# EAGLE design kaaEmonitor_2v0 (EAGLE 6.5.0)
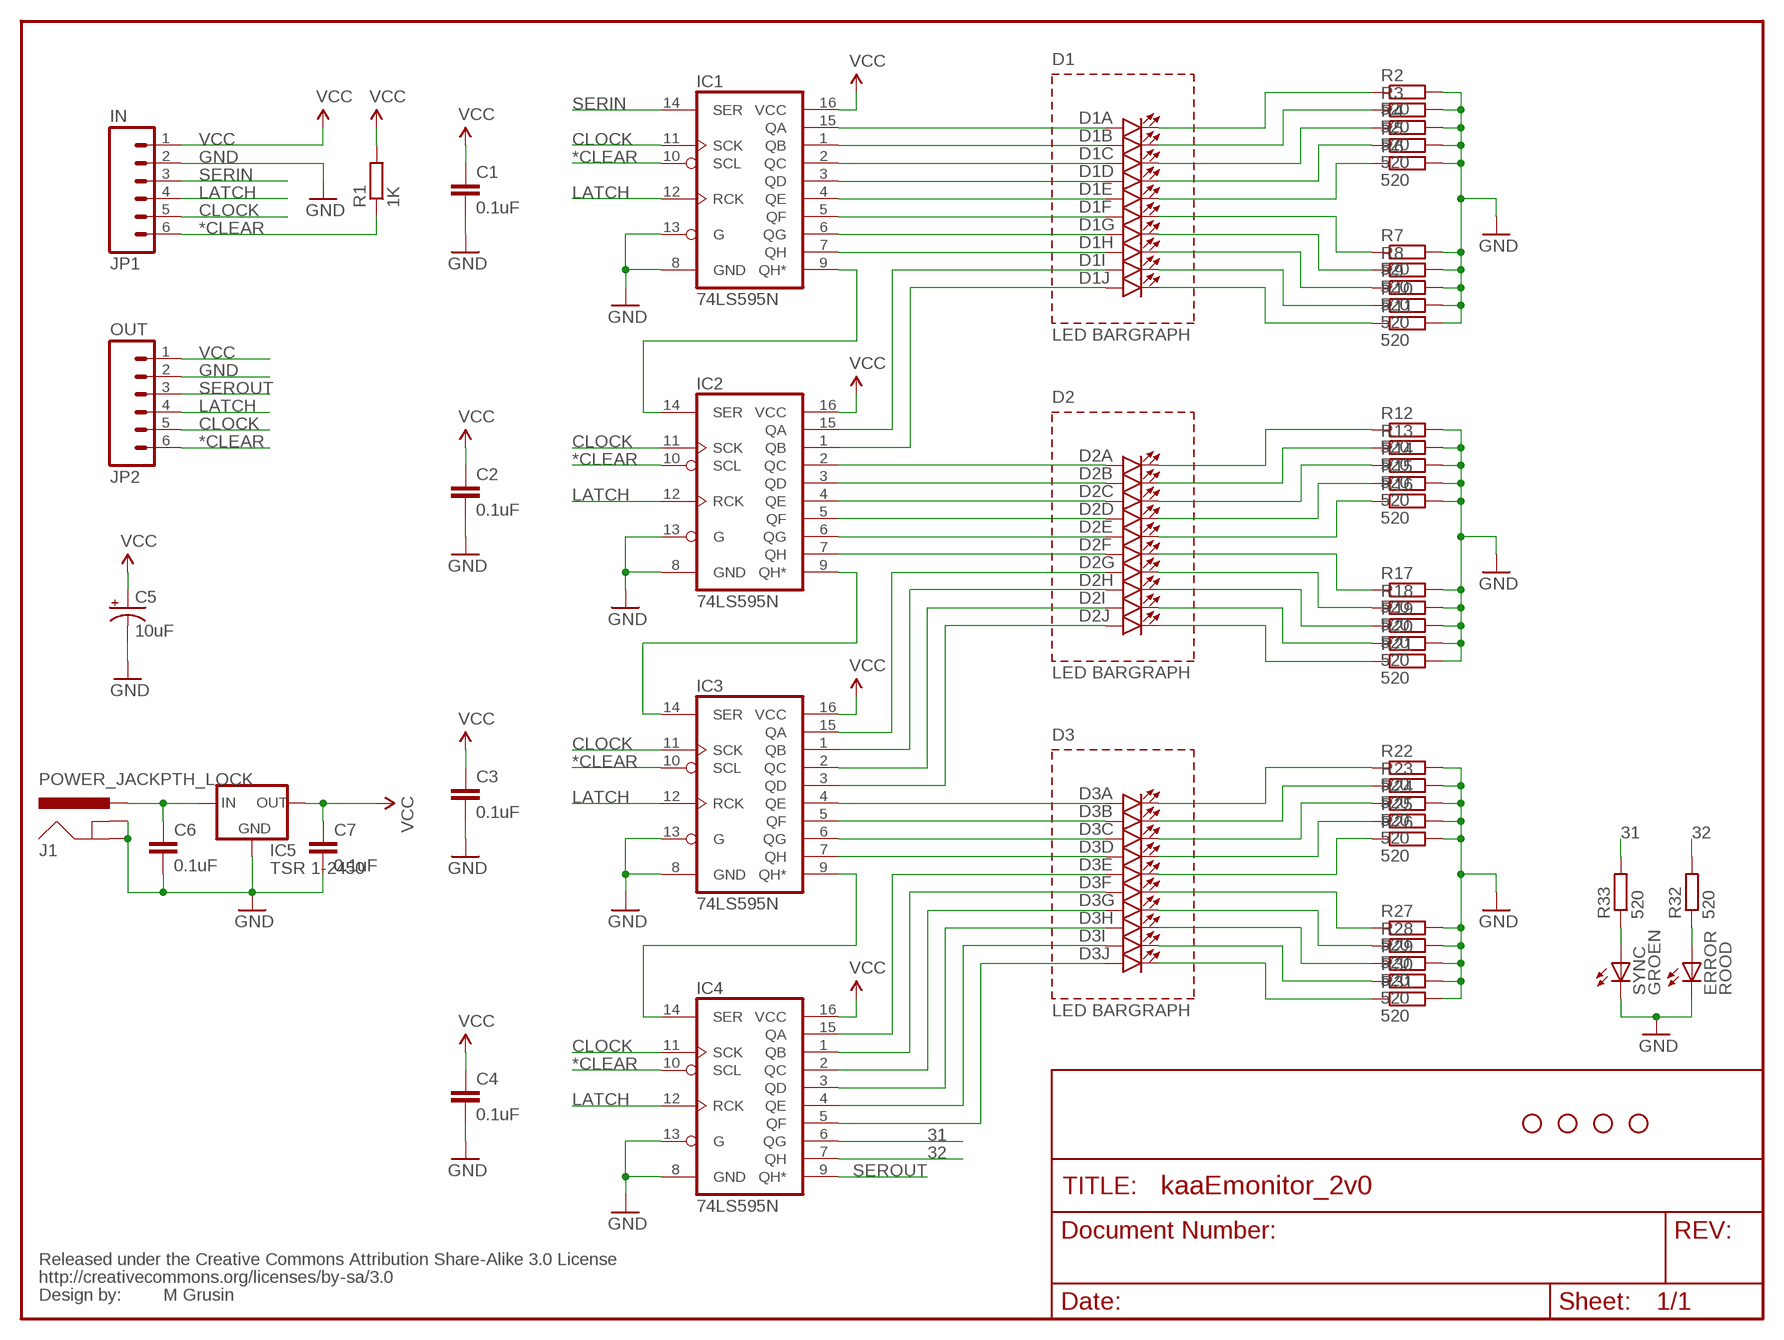
[diagram p0: schematic, sheet 1]

## Parts
C1  0.1uF  CAPPTH2  [CAP-PTH-SMALL2]
C2  0.1uF  CAPPTH2  [CAP-PTH-SMALL2]
C3  0.1uF  CAPPTH2  [CAP-PTH-SMALL2]
C4  0.1uF  CAPPTH2  [CAP-PTH-SMALL2]
C5  10uF  CAP_POLPTH2  [CPOL-RADIAL-10UF-25V]
C6  0.1uF  CAPPTH2  [CAP-PTH-SMALL2]
C7  0.1uF  CAPPTH2  [CAP-PTH-SMALL2]
D1  LED_BARGRAPH_10  [LED_BARGAPH_10]
D2  LED_BARGRAPH_10  [LED_BARGAPH_10]
D3  LED_BARGRAPH_10  [LED_BARGAPH_10]
ERROR  ROOD  LED3MM  [LED3MM]
IC1  74LS595N  [DIL16]
IC2  74LS595N  [DIL16]
IC3  74LS595N  [DIL16]
IC4  74LS595N  [DIL16]
IC5  TSR 1-2450  V_REG_78XXSINK  [TO220-IGO]
J1  POWER_JACKPTH_LOCK  [POWER_JACK_PTH_LOCK]
JP1  IN  M06SIP  [1X06]
JP2  OUT  M06SIP  [1X06]
R1  1K  R-EU_0204/5  [0204/5]
R2  520  R-EU_0204/5  [0204/5]
R3  520  R-EU_0204/5  [0204/5]
R4  520  R-EU_0204/5  [0204/5]
R5  520  R-EU_0204/5  [0204/5]
R6  520  R-EU_0204/5  [0204/5]
R7  520  R-EU_0204/5  [0204/5]
R8  520  R-EU_0204/5  [0204/5]
R9  520  R-EU_0204/5  [0204/5]
R10  520  R-EU_0204/5  [0204/5]
R11  520  R-EU_0204/5  [0204/5]
R12  520  R-EU_0204/5  [0204/5]
R13  520  R-EU_0204/5  [0204/5]
R14  520  R-EU_0204/5  [0204/5]
R15  520  R-EU_0204/5  [0204/5]
R16  520  R-EU_0204/5  [0204/5]
R17  520  R-EU_0204/5  [0204/5]
R18  520  R-EU_0204/5  [0204/5]
R19  520  R-EU_0204/5  [0204/5]
R20  520  R-EU_0204/5  [0204/5]
R21  520  R-EU_0204/5  [0204/5]
R22  520  R-EU_0204/5  [0204/5]
R23  520  R-EU_0204/5  [0204/5]
R24  520  R-EU_0204/5  [0204/5]
R25  520  R-EU_0204/5  [0204/5]
R26  520  R-EU_0204/5  [0204/5]
R27  520  R-EU_0204/5  [0204/5]
R28  520  R-EU_0204/5  [0204/5]
R29  520  R-EU_0204/5  [0204/5]
R30  520  R-EU_0204/5  [0204/5]
R31  520  R-EU_0204/5  [0204/5]
R32  520  R-EU_0204/5  [0204/5]
R33  520  R-EU_0204/5  [0204/5]
SO1  STAND-OFF  [STAND-OFF]
SO2  STAND-OFF  [STAND-OFF]
SO3  STAND-OFF  [STAND-OFF]
SO4  STAND-OFF  [STAND-OFF]
SYNC  GROEN  LED3MM  [LED3MM]
U$6  CREATIVE_COMMONS  [CREATIVE_COMMONS]

## Nets
31: IC4.6(QG) R33.2
32: IC4.7(QH) R32.2
*CLEAR: IC1.10(SCL) IC2.10(SCL) IC3.10(SCL) IC4.10(SCL) JP1.6 JP2.6 R1.1
CLOCK: IC1.11(SCK) IC2.11(SCK) IC3.11(SCK) IC4.11(SCK) JP1.5 JP2.5
GND: C1.2 C2.2 C3.2 C4.2 C5.2(-) C6.2 C7.2 ERROR.K(C) IC1.8(GND) IC1.13(G) IC2.8(GND) IC2.13(G) IC3.8(GND) IC3.13(G) IC4.8(GND) IC4.13(G) IC5.GND J1.GND J1.GNDBREAK JP1.2 JP2.2 R2.2 R3.2 R4.2 R5.2 R6.2 R7.2 R8.2 R9.2 R10.2 R11.2 R12.2 R13.2 R14.2 R15.2 R16.2 R17.2 R18.2 R19.2 R20.2 R21.2 R22.2 R23.2 R24.2 R25.2 R26.2 R27.2 R28.2 R29.2 R30.2 R31.2 SYNC.K(C)
LATCH: IC1.12(RCK) IC2.12(RCK) IC3.12(RCK) IC4.12(RCK) JP1.4 JP2.4
N$1: D1.1(A:A) IC1.15(QA)
N$2: D1.2(B:A) IC1.1(QB)
N$3: D1.3(C:A) IC1.2(QC)
N$4: D1.4(D:A) IC1.3(QD)
N$5: D1.5(E:A) IC1.4(QE)
N$6: D1.6(F:A) IC1.5(QF)
N$7: D1.7(G:A) IC1.6(QG)
N$8: D1.8(H:A) IC1.7(QH)
N$9: D1.9(I:A) IC2.15(QA)
N$10: D1.10(J:A) IC2.1(QB)
N$11: D2.8(H:A) IC3.1(QB)
N$12: D2.7(G:A) IC3.15(QA)
N$13: D2.9(I:A) IC3.2(QC)
N$14: D2.10(J:A) IC3.3(QD)
N$15: D3.1(A:A) IC3.4(QE)
N$16: D3.2(B:A) IC3.5(QF)
N$17: D3.3(C:A) IC3.6(QG)
N$18: D3.4(D:A) IC3.7(QH)
N$19: D2.1(A:A) IC2.2(QC)
N$20: D2.2(B:A) IC2.3(QD)
N$21: D2.3(C:A) IC2.4(QE)
N$22: D2.4(D:A) IC2.5(QF)
N$23: D2.5(E:A) IC2.6(QG)
N$24: D2.6(F:A) IC2.7(QH)
N$25: D1.20(A:C) R2.1
N$26: D1.19(B:C) R3.1
N$27: D3.5(E:A) IC4.15(QA)
N$28: D3.6(F:A) IC4.1(QB)
N$29: D1.18(C:C) R4.1
N$30: D1.17(D:C) R5.1
N$31: D1.16(E:C) R6.1
N$32: D1.15(F:C) R7.1
N$33: D1.14(G:C) R8.1
N$34: D1.13(H:C) R9.1
N$35: D1.12(I:C) R10.1
N$36: D1.11(J:C) R11.1
N$37: D2.20(A:C) R12.1
N$38: D2.19(B:C) R13.1
N$39: D3.7(G:A) IC4.2(QC)
N$40: D3.8(H:A) IC4.3(QD)
N$41: D3.9(I:A) IC4.4(QE)
N$42: D3.10(J:A) IC4.5(QF)
N$43: D2.18(C:C) R14.1
N$44: D2.17(D:C) R15.1
N$45: D2.16(E:C) R16.1
N$46: D2.15(F:C) R17.1
N$47: D2.14(G:C) R18.1
N$48: D2.13(H:C) R19.1
N$49: D2.12(I:C) R20.1
N$50: D2.11(J:C) R21.1
N$51: D3.20(A:C) R22.1
N$52: D3.19(B:C) R23.1
N$53: D3.18(C:C) R24.1
N$54: D3.17(D:C) R25.1
N$55: D3.16(E:C) R26.1
N$56: D3.15(F:C) R27.1
N$57: D3.14(G:C) R28.1
N$58: D3.13(H:C) R29.1
N$59: D3.12(I:C) R30.1
N$60: D3.11(J:C) R31.1
N$62: C6.1 IC5.IN J1.PWR
N$63: R33.1 SYNC.A
N$64: ERROR.A R32.1
N$65: IC1.9(QH*) IC2.14(SER)
N$66: IC2.9(QH*) IC3.14(SER)
N$67: IC3.9(QH*) IC4.14(SER)
SERIN: IC1.14(SER) JP1.3
SEROUT: IC4.9(QH*) JP2.3
VCC: C1.1 C2.1 C3.1 C4.1 C5.1(+) C7.1 IC1.16(VCC) IC2.16(VCC) IC3.16(VCC) IC4.16(VCC) IC5.OUT JP1.1 JP2.1 R1.2

## Notes on the sheet
- D1
- LED BARGRAPH
- D2
- LED BARGRAPH
- D3
- LED BARGRAPH
- M Grusin

## Library data of the parts
C1-C4 C6 C7 = SparkFun:CAP: Capacitor Standard 0603 ceramic capacitor, and 0.1" leaded capacitor.
C5 = SparkFun:CAP_POL: Capacitor Polarized These are standard SMD and PTH capacitors. Normally 10uF, 47uF, and 100uF in electrolytic and tantalum varieties. Always verify the external diameter of the through hole cap, it varies with capacity, voltage, and manufacturer. The EIA devices should be standard.
D1-D3 = SparkFun:LED_BARGRAPH_10: 10-Segment LED Bar Graph SFE part numbers: COM-09935 (red, Vf = 2.1V, Ifmax = 20mA) COM-09936 (yellow, Vf = 2.1V, Ifmax = 20mA) COM-09937 (blue, Vf = 3.4V, Ifmax = 20mA) COM-09938 (green, Vf = 3.4V, Ifmax = 20mA)
ERROR SYNC = SparkFun-LED:LED: LEDs Standard schematic elements and footprints for 5mm, 3mm, 1206, and 0603 sized LEDs. 5mm - Spark Fun Electronics SKU : COM-00529 (and others)
IC1-IC4 = SparkFun:74*595: 8-bit SHIFT REGISTER, output latch
IC5 = SparkFun-PowerIC:V_REG_78XX: Voltage Regulator Standard 7805 5V regulator. IGO (Input Ground Output). Spark Fun Electronics SKU : COM-00107
J1 = SparkFun-Connectors:POWER_JACK: Power Jack This is the standard 5.5mm barrel jack for power. The PTH is the most common, proven, reliable, footprint. The Slot footprint only works if the mill layer is transmitted to the PCB fab house so be warned. Mating wall wart : TOL-00298 (and others); PROD_ID: PRT-00119
JP1 JP2 = SparkFun:M06: Header 6 Standard 6-pin 0.1" header. Use with straight break away headers (SKU : PRT-00116), right angle break away headers (PRT-00553), swiss pins (PRT-00743), machine pins (PRT-00117), and female headers (PRT-00115). Molex polarized connector foot print use with SKU : PRT-08094 with associated crimp pins and housings. NOTES ON THE VARIANTS LOCK and LOCK_LONGPADS... This footprint was designed to help hold the alignment of a through-hole component (i.e. 6-pin header) while soldering it into place. You may notice that each hole has been shifted either up or down by 0.005 of an inch from it's more standard position (which is a perfectly straight line). This slight alteration caused the pins (the squares in the middle) to touch the edges of the holes. Because they are alternating, it causes a "brace" to hold the component in place. 0.005 has proven to be the perfect amount of "off-center" position when using our standard breakaway headers. Although looks a little odd when you look at the bare footprint, once you have a header in there, the alteration is very hard to notice. Also, if you push a header all the way into place, it is covered up entirely on the bottom side. This idea of altering the position of holes to aid alignment will be further integrated into the Sparkfun Library for other footprints. It can help hold any component with 3 or more connection pins.
R1-R33 = resistor:R-EU_: RESISTOR, European symbol
SO1-SO4 = SparkFun:STAND-OFF: Stand Off This is the mechanical footprint for a #4 phillips button head screw. Use the keepout ring to avoid running the screw head into surrounding components. SKU : PRT-00447
U$6 = SparkFun:CREATIVE_COMMONS

## Board
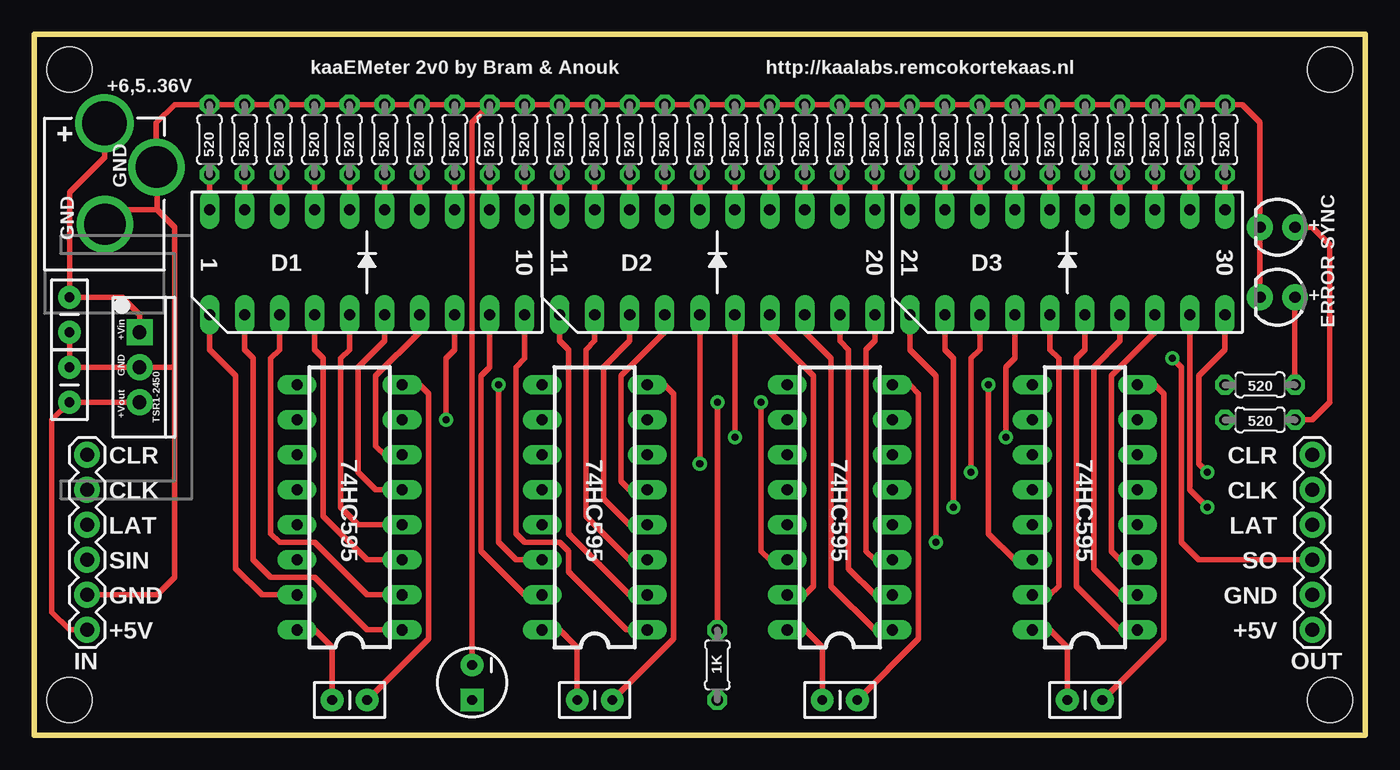
[diagram p1: board, top side]
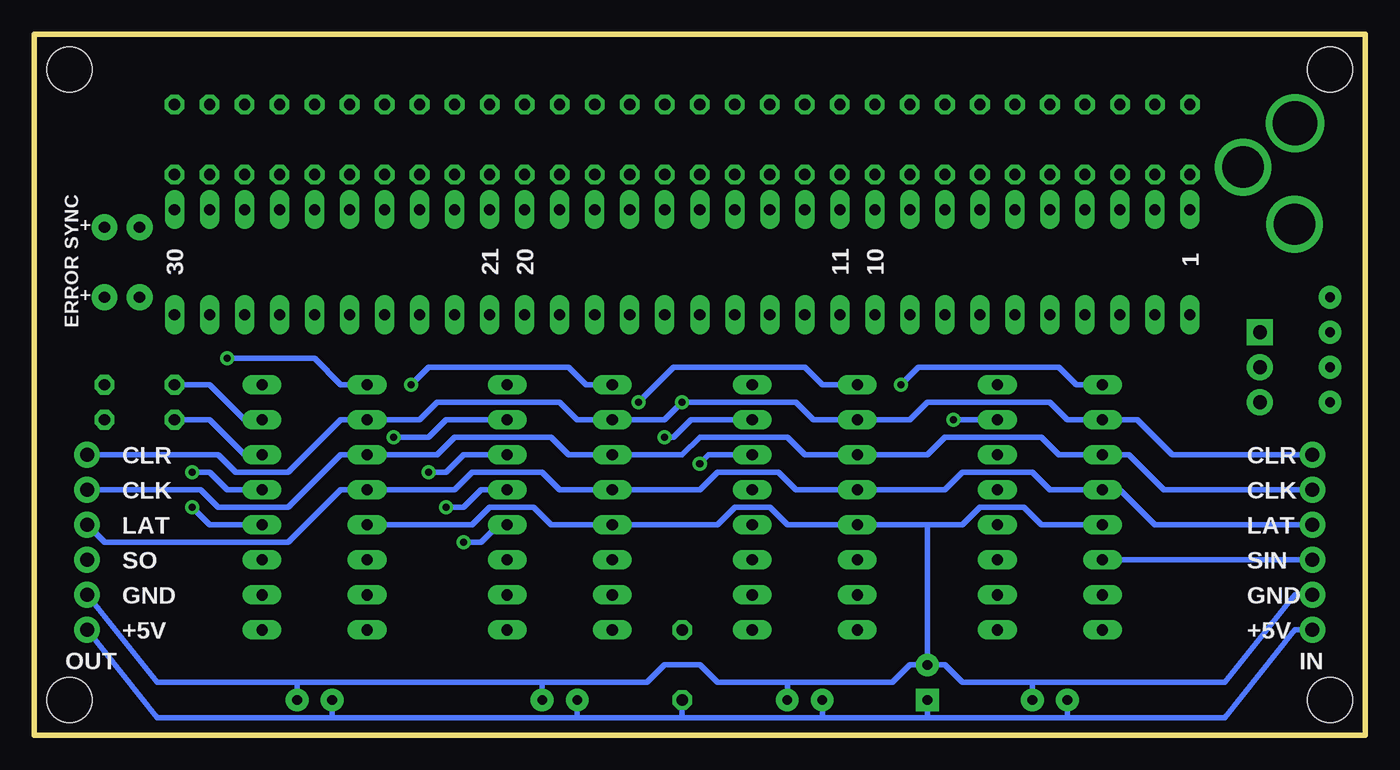
[diagram p2: board, bottom side, seen from below]

Size 96.52 x 50.8 mm. Coordinates in mm from the lower left corner, seen from the top.
Outline: 96.52,0 0,0 0,50.8 96.52,50.8 96.52,0
Copper layers (1*16): Top 0.035mm / dielectric 1.5mm / Bottom 0.035mm
Design rules "SparkFun": minimum track width 8mil, minimum drill 20mil, track to track 8mil, track to pad 8mil, pad to pad 8mil, via to via 8mil, smd to smd 8mil, copper to edge 8mil, drill to drill 8mil, minimum pad ring 12mil, minimum via ring 10mil, stop-mask expansion 4mil, vias tented up to drill 20mil, thermal gap 10mil

### Footprints (pad centres in the part's own frame; a part is rotated, then mirrored left to right if it is on the bottom)
CAP-PTH-SMALL2 = drill 0.7 pad 1.651: 1 0,0; 2 2.54,0
CPOL-RADIAL-10UF-25V = drill 0.7 pad 1.651 square: 1 1.27,0 | drill 0.7 pad 1.651: 2 -1.27,0
LED_BARGAPH_10 = drill 0.813 long: 1 -11.43,-3.81; 2 -8.89,-3.81; 3 -6.35,-3.81; 4 -3.81,-3.81; 5 -1.27,-3.81; 6 1.27,-3.81; 7 3.81,-3.81; 8 6.35,-3.81; 9 8.89,-3.81; 10 11.43,-3.81; 11 11.43,3.81; 12 8.89,3.81; 13 6.35,3.81; 14 3.81,3.81; 15 1.27,3.81; 16 -1.27,3.81; 17 -3.81,3.81; 18 -6.35,3.81; 19 -8.89,3.81; 20 -11.43,3.81
LED3MM = drill 0.813 pad 1.88: A -1.27,0; K 1.27,0
DIL16 = drill 0.813 long: 1 -8.89,-3.81; 2 -6.35,-3.81; 3 -3.81,-3.81; 4 -1.27,-3.81; 5 1.27,-3.81; 6 3.81,-3.81; 7 6.35,-3.81; 8 8.89,-3.81; 9 8.89,3.81; 10 6.35,3.81; 11 3.81,3.81; 12 1.27,3.81; 13 -1.27,3.81; 14 -3.81,3.81; 15 -6.35,3.81; 16 -8.89,3.81
TO220-IGO = drill 1 pad 1.88: GND 0,0; OUT 2.54,0 | drill 1 pad 1.88 square: IN -2.54,0
POWER_JACK_PTH_LOCK = drill 2.997 pad 4.115: GND 0.025,6.557; GNDBREAK 3.762,10.7 | drill 3.2 pad 4.115: PWR 0,13.878
1X06 = drill 1.016 pad 1.88: 1 0,0; 2 2.54,0; 3 5.08,0; 4 7.62,0; 5 10.16,0; 6 12.7,0
0204/5 = drill 0.813 octagon: 1 -2.54,0; 2 2.54,0
STAND-OFF = hole 3.302: 0,0

### Placement (x,y rotation side)
C1  21.59,2.54 0 top
C2  39.37,2.54 0 top
C3  57.15,2.54 0 top
C4  74.93,2.54 0 top
C5  31.75,3.81 270 top
C6  2.54,31.75 270 top
C7  2.54,24.13 90 top
D1  24.13,34.29 0 top
D2  49.53,34.29 0 top
D3  74.93,34.29 0 top
ERROR  90.17,31.75 180 top
IC1  22.86,16.51 90 top
IC2  40.64,16.51 90 top
IC3  58.42,16.51 90 top
IC4  76.2,16.51 90 top
IC5  7.62,26.67 270 top
J1  5.08,30.48 0 top
JP1  3.81,7.62 90 top
JP2  92.71,7.62 90 top
R1  49.53,5.08 270 top
R2  12.7,43.18 90 top
R3  15.24,43.18 90 top
R4  17.78,43.18 90 top
R5  20.32,43.18 90 top
R6  22.86,43.18 90 top
R7  25.4,43.18 90 top
R8  27.94,43.18 90 top
R9  30.48,43.18 90 top
R10  33.02,43.18 90 top
R11  35.56,43.18 90 top
R12  38.1,43.18 90 top
R13  40.64,43.18 90 top
R14  43.18,43.18 90 top
R15  45.72,43.18 90 top
R16  48.26,43.18 90 top
R17  50.8,43.18 90 top
R18  53.34,43.18 90 top
R19  55.88,43.18 90 top
R20  58.42,43.18 90 top
R21  60.96,43.18 90 top
R22  63.5,43.18 90 top
R23  66.04,43.18 90 top
R24  68.58,43.18 90 top
R25  71.12,43.18 90 top
R26  73.66,43.18 90 top
R27  76.2,43.18 90 top
R28  78.74,43.18 90 top
R29  81.28,43.18 90 top
R30  83.82,43.18 90 top
R31  86.36,43.18 90 top
R32  88.9,25.4 180 top
R33  88.9,22.86 180 top
SO1  2.54,48.26 0 top
SO2  93.98,48.26 0 top
SO3  93.98,2.54 0 top
SO4  2.54,2.54 0 top
SYNC  90.17,36.83 180 top
U$6  0,0 0 top

### Tracks (layer width: path | path; a pad name or v marks a point on that pad's centre or on a via)
31
  Bottom 0.406: IC4.6 81.28,20.32 83.82,22.86 R33.2
32
  Bottom 0.406: IC4.7 81.28,22.86 83.82,25.4 R32.2
*CLEAR  (via drill 0.51)
  Top 0.406: R1.1 v49.53,24.13
  Bottom 0.406: JP1.6 13.97,20.32 16.51,22.86 IC1.10 21.59,22.86 22.86,24.13 31.75,24.13 33.02,22.86 IC2.10 40.01,22.86 41.27,24.13 v49.53,24.13 50.8,22.86 IC3.10 57.15,22.86 58.42,24.13 67.31,24.13 68.58,22.86 IC4.10 74.3,22.86 78.11,19.05 81.92,19.05 83.19,20.32 JP2.6
CLOCK
  Bottom 0.406: JP1.5 14.61,17.78 17.14,20.32 IC1.11 22.23,20.32 23.5,21.59 30.48,21.59 31.75,20.32 IC2.11 40.64,20.32 41.91,21.59 48.26,21.59 49.53,20.32 IC3.11 57.78,20.32 59.05,21.59 66.04,21.59 67.31,20.32 IC4.11 74.3,20.32 78.11,16.51 83.19,16.51 84.45,17.78 JP2.5
GND
  Top 0.406: IC1.8 27.94,25.4 28.57,24.77 28.57,6.99 C1.2 | IC2.8 45.72,25.4 46.35,24.77 46.35,6.99 C2.2 | IC3.8 63.5,25.4 64.14,24.77 64.14,6.99 C3.2 | IC4.8 81.28,25.4 81.92,24.77 81.92,6.99 C4.2 | ERROR.K SYNC.K 88.9,44.45 87.63,45.72 R31.2 R30.2 R29.2 R28.2 R27.2 R26.2 R25.2 R24.2 R23.2 R22.2 R21.2 R20.2 R19.2 R18.2 R17.2 R16.2 R15.2 R14.2 R13.2 R12.2 R11.2 R10.2 | 10.16,26.67 10.16,36.83 8.89,38.1 | 10.16,26.67 10.16,11.43 8.89,10.16 JP1.2 | C6.2 C7.2 IC5.GND 10.16,26.67 | J1.GNDBREAK 8.84,44.4 10.16,45.72 R2.2 R3.2 R4.2 R5.2 R6.2 R7.2 R8.2 R9.2 R10.2 | 8.89,38.1 8.89,40.64 | J1.GND 6.17,38.1 8.89,38.1 | R10.2 31.75,44.45 C5.2
  Bottom 0.406: C5.2 30.48,5.08 29.21,3.81 24.13,3.81 | 24.13,3.81 C1.2 | C5.2 33.02,5.08 34.29,3.81 41.91,3.81 | 41.91,3.81 C2.2 | 77.47,3.81 C4.2 | 59.69,3.81 77.47,3.81 | 59.69,3.81 C3.2 | IC4.13 64.77,15.24 63.5,16.51 60.33,16.51 59.05,15.24 IC3.13 46.99,15.24 45.72,16.51 43.18,16.51 41.91,15.24 IC2.13 31.75,15.24 | IC1.13 23.5,15.24 24.77,16.51 27.94,16.51 29.21,15.24 31.75,15.24 | C5.2 31.75,15.24 | 77.47,3.81 87.63,3.81 JP2.2 | JP1.2 5.08,10.16 10.16,3.81 24.13,3.81 | 41.91,3.81 46.99,3.81 48.26,5.08 50.8,5.08 52.07,3.81 59.69,3.81
LATCH
  Bottom 0.406: JP1.4 15.24,15.24 17.78,17.78 IC1.12 22.86,17.78 24.13,19.05 29.21,19.05 30.48,17.78 IC2.12 41.27,17.78 42.55,19.05 46.99,19.05 48.26,17.78 IC3.12 58.42,17.78 59.69,19.05 64.77,19.05 66.04,17.78 IC4.12 74.3,17.78 78.11,13.97 91.44,13.97 JP2.4
N$1
  Top 0.406: D1.1 12.7,27.94 14.61,26.04 14.61,12.06 16.51,10.16 IC1.15
N$2
  Top 0.406: IC1.1 24.13,7.62 20.32,11.43 17.14,11.43 15.88,12.7 15.88,27.3 15.24,27.94 D1.2
N$3
  Top 0.406: D1.3 17.78,27.94 17.14,27.3 17.14,14.61 17.78,13.97 20.32,13.97 24.13,10.16 IC1.2
N$4
  Top 0.406: IC1.3 24.13,12.7 20.95,15.88 20.95,27.3 20.32,27.94 D1.4
N$5
  Top 0.406: D1.5 22.86,27.94 22.23,27.3 22.23,16.51 23.5,15.24 IC1.4
N$6
  Top 0.406: IC1.5 24.77,17.78 23.5,19.05 23.5,26.67 25.4,28.57 D1.6
N$7
  Top 0.406: D1.7 27.94,29.21 24.77,26.04 24.77,20.95 25.4,20.32 IC1.6
N$8  (via drill 0.51)
  Top 0.406: v29.84,22.86 29.84,27.3 30.48,27.94 D1.8
  Bottom 0.406: IC1.7 v29.84,22.86
N$9
  Top 0.406: D1.9 33.02,26.67 32.38,26.04 32.38,13.34 35.56,10.16 IC2.15
N$10
  Top 0.406: D1.10 35.56,27.3 34.92,26.67 34.92,14.61 35.56,13.97 38.1,13.97 38.73,13.34 38.73,11.85 42.96,7.62 IC2.1
N$11
  Top 0.406: IC3.1 60.96,7.62 57.78,10.79 57.78,27.3 55.88,29.21 D2.8
N$12
  Top 0.406: D2.7 53.34,29.21 56.52,26.04 56.52,10.79 55.88,10.16 IC3.15
N$13
  Top 0.406: D2.9 58.42,28.57 59.05,27.94 59.05,12.06 60.96,10.16 IC3.2
N$14
  Top 0.406: IC3.3 60.96,12.7 60.33,13.34 60.33,27.94 60.96,28.57 D2.10
N$15  (via drill 0.51)
  Top 0.406: D3.1 63.5,27.94 65.41,26.04 v65.41,13.97
  Bottom 0.406: IC3.4 62.87,15.24 64.14,13.97 v65.41,13.97
N$16  (via drill 0.51)
  Top 0.406: D3.2 66.04,27.94 66.67,27.3 v66.67,16.51
  Bottom 0.406: IC3.5 64.14,17.78 65.41,16.51 v66.67,16.51
N$17  (via drill 0.51)
  Top 0.406: D3.3 68.58,27.94 67.94,27.3 v67.94,19.05
  Bottom 0.406: IC3.6 65.41,20.32 66.67,19.05 v67.94,19.05
N$18  (via drill 0.51)
  Top 0.406: D3.4 71.12,27.3 70.48,26.67 v70.48,21.59
  Bottom 0.406: IC3.7 66.67,22.86 67.94,21.59 v70.48,21.59
N$19
  Top 0.406: IC2.2 43.18,10.16 38.73,14.61 38.73,27.94 38.1,28.57 D2.1
N$20
  Top 0.406: D2.2 40.64,28.57 40.01,27.94 40.01,15.88 43.18,12.7 IC2.3
N$21
  Top 0.406: D2.3 43.18,28.57 41.27,26.67 41.27,17.14 43.18,15.24 IC2.4
N$22
  Top 0.406: D2.4 45.72,29.21 42.55,26.04 42.55,18.41 43.18,17.78 IC2.5
N$23  (via drill 0.51)
  Top 0.406: v48.26,19.68 D2.5
  Bottom 0.406: IC2.6 47.62,20.32 v48.26,19.68
N$24  (via drill 0.51)
  Top 0.406: v50.8,21.59 D2.6
  Bottom 0.406: IC2.7 48.9,22.86 50.16,21.59 v50.8,21.59
N$25
  Top 0.406: R2.1 D1.20
N$26
  Top 0.406: R3.1 D1.19
N$27
  Top 0.406: IC4.15 73.66,10.16 74.3,10.79 74.3,27.3 73.66,27.94 D3.5
N$28
  Top 0.406: D3.6 76.2,27.94 75.56,27.3 75.56,10.79 78.74,7.62 IC4.1
N$29
  Top 0.406: R4.1 D1.18
N$30
  Top 0.406: R5.1 D1.17
N$31
  Top 0.406: R6.1 D1.16
N$32
  Top 0.406: R7.1 D1.15
N$33
  Top 0.406: R8.1 D1.14
N$34
  Top 0.406: R9.1 D1.13
N$35
  Top 0.406: R10.1 D1.12
N$36
  Top 0.406: R11.1 D1.11
N$37
  Top 0.406: R12.1 D2.20
N$38
  Top 0.406: R13.1 D2.19
N$39
  Top 0.406: IC4.2 78.74,10.16 76.83,12.06 76.83,26.67 78.74,28.57 D3.7
N$40
  Top 0.406: D3.8 81.28,29.21 78.11,26.04 78.11,13.34 78.74,12.7 IC4.3
N$41  (via drill 0.51)
  Top 0.406: D3.9 83.82,17.78 v85.09,16.51
  Bottom 0.406: v85.09,16.51 83.82,15.24 IC4.4
N$42  (via drill 0.51)
  Top 0.406: D3.10 86.36,27.94 84.45,26.04 84.45,19.68 v85.09,19.05
  Bottom 0.406: v85.09,19.05 83.82,19.05 82.55,17.78 IC4.5
N$43
  Top 0.406: R14.1 D2.18
N$44
  Top 0.406: R15.1 D2.17
N$45
  Top 0.406: R16.1 D2.16
N$46
  Top 0.406: R17.1 D2.15
N$47
  Top 0.406: R18.1 D2.14
N$48
  Top 0.406: R19.1 D2.13
N$49
  Top 0.406: R20.1 D2.12
N$50
  Top 0.406: R21.1 D2.11
N$51
  Top 0.406: R22.1 D3.20
N$52
  Top 0.406: R23.1 D3.19
N$53
  Top 0.406: R24.1 D3.18
N$54
  Top 0.406: R25.1 D3.17
N$55
  Top 0.406: R26.1 D3.16
N$56
  Top 0.406: R27.1 D3.15
N$57
  Top 0.406: R28.1 D3.14
N$58
  Top 0.406: R29.1 D3.13
N$59
  Top 0.406: R30.1 D3.12
N$60
  Top 0.406: R31.1 D3.11
N$62
  Top 0.406: IC5.IN 7.62,30.48 6.35,31.75 C6.1 2.54,39.37 5.08,41.91 J1.PWR
N$63
  Top 0.406: R33.1 92.71,22.86 93.98,24.13 93.98,35.56 92.71,36.83 SYNC.A
N$64
  Top 0.406: R32.1 ERROR.A
N$65  (via drill 0.51)
  Top 0.406: v33.66,25.4 33.66,13.97 34.92,12.7 IC2.14
  Bottom 0.406: IC1.9 20.95,25.4 22.23,26.67 32.38,26.67 v33.66,25.4
N$66  (via drill 0.51)
  Top 0.406: v52.7,24.13 52.7,13.34 53.34,12.7 IC3.14
  Bottom 0.406: IC2.9 39.37,25.4 40.64,26.67 50.16,26.67 v52.7,24.13
N$67  (via drill 0.51)
  Top 0.406: v69.22,25.4 69.22,14.61 71.12,12.7 IC4.14
  Bottom 0.406: IC3.9 56.52,25.4 57.78,26.67 67.94,26.67 v69.22,25.4
SERIN
  Bottom 0.406: JP1.3 IC1.14
SEROUT  (via drill 0.51)
  Top 0.406: JP2.3 84.45,12.7 83.19,13.97 83.19,26.67 v82.55,27.3
  Bottom 0.406: v82.55,27.3 76.2,27.3 74.3,25.4 IC4.9
VCC
  Top 0.406: C1.1 21.59,6.35 20.32,7.62 IC1.16 | C2.1 39.37,6.35 38.1,7.62 IC2.16 | C3.1 57.15,6.35 55.88,7.62 IC3.16 | C4.1 74.93,6.35 73.66,7.62 IC4.16 | IC5.OUT C7.1 1.27,22.86 1.27,8.89 2.54,7.62 JP1.1
  Bottom 0.406: 21.59,1.27 10.16,1.27 5.08,7.62 JP1.1 | 21.59,1.27 C1.1 | 31.75,1.27 C5.1 | 21.59,1.27 31.75,1.27 | 39.37,1.27 C2.1 | 31.75,1.27 39.37,1.27 | 39.37,1.27 49.53,1.27 | 49.53,1.27 57.15,1.27 | 57.15,1.27 C3.1 | 57.15,1.27 74.93,1.27 | 74.93,1.27 C4.1 | 74.93,1.27 87.63,1.27 JP2.1 | R1.2 49.53,1.27

### Text on the board
tPlace: +6,5..36V | kaaEMeter 2v0 by Bram & Anouk | http://kaalabs.remcokortekaas.nl | + | 520 | 520 | 520 | 520 | 520 | 520 | 520 | 520 | 520 | 520 | 520 | 520 | 520 | 520 | 520 | 520 | 520 | 520 | 520 | 520 | 520 | 520 | 520 | 520 | 520 | 520 | 520 | 520 | 520 | 520 | GND | + | + | GND | 1 | 10 | 11 | 20 | 21 | 30 | SYNC | D1 | D2 | D3 | + | +Vin | ERROR | GND | TSR1-2450 | 520 | +Vout | 520 | CLR | CLR | 74HC595 | 74HC595 | 74HC595 | 74HC595 | CLK | CLK | LAT | LAT | SO | SIN | GND | GND | +5V | +5V | IN | OUT | 1K
bPlace: + | SYNC | 1 | 10 | 11 | 20 | 21 | 30 | + | ERROR | CLR | CLR | CLK | CLK | LAT | LAT | SIN | SO | GND | GND | +5V | +5V | IN | OUT
tValues: M Grusin
Document: 2.00" | 1.90" | 1.55" | 1.15" | 0.10" | 0.00" | 0.00" | 0.10" | 2.90" | 3.00"